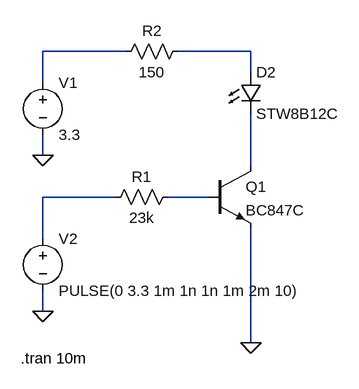
[diagram p0: schematic Draft1.asc]
Draft1.asc, the LTspice schematic file:
Version 4
SHEET 1 880 680
WIRE 240 -160 112 -160
WIRE 432 -160 320 -160
WIRE 432 -128 432 -160
WIRE 112 -112 112 -160
WIRE 112 0 112 -32
WIRE 432 16 432 -64
WIRE 224 64 112 64
WIRE 368 64 304 64
WIRE 112 128 112 64
WIRE 112 240 112 208
WIRE 432 288 432 112
FLAG 432 288 0
FLAG 112 240 0
FLAG 112 0 0
SYMBOL res 320 48 R90
WINDOW 0 0 56 VBottom 2
WINDOW 3 32 56 VTop 2
SYMATTR InstName R1
SYMATTR Value 23k
SYMBOL npn 368 16 R0
SYMATTR InstName Q1
SYMATTR Value BC847C
SYMBOL res 336 -176 R90
WINDOW 0 0 56 VBottom 2
WINDOW 3 32 56 VTop 2
SYMATTR InstName R2
SYMATTR Value 150
SYMBOL voltage 112 -128 R0
WINDOW 123 0 0 Left 0
WINDOW 39 0 0 Left 0
SYMATTR InstName V1
SYMATTR Value 3.3
SYMBOL voltage 112 112 R0
WINDOW 123 0 0 Left 0
WINDOW 39 0 0 Left 0
SYMATTR InstName V2
SYMATTR Value PULSE(0 3.3 1m 1n 1n 1m 2m 10)
SYMBOL LED 416 -128 R0
SYMATTR InstName D2
SYMATTR Value STW8B12C
TEXT 78 312 Left 2 !.tran 10m

The netlist it stands for:
* Draft1.asc
R1 N005 N004 23k
Q1 N003 N005 0 0 BC847C
R2 N002 N001 150
V1 N001 0 3.3
V2 N004 0 PULSE(0 3.3 1m 1n 1n 1m 2m 10)
D2 N002 N003 STW8B12C
.model D D
.lib standard.dio
.model NPN NPN
.model PNP PNP
.lib standard.bjt
.tran 10m
.backanno
.end